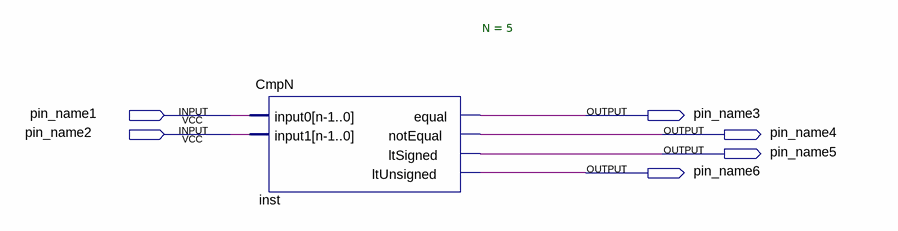
[diagram p0: schematic sheet]
// Quartus schematic CmpN_Demo.bdf as structural Verilog: 1 symbols, 6 pins
module CmpN_Demo (
  input  pin_name1,
  input  pin_name2,
  output pin_name3,
  output pin_name4,
  output pin_name5,
  output pin_name6
);

  CmpN #(.N(5)) inst (
    .input0({5{pin_name1}}), .input1({5{pin_name2}}), .equal(pin_name3), .notEqual(pin_name4),
    .ltSigned(pin_name5), .ltUnsigned(pin_name6));
endmodule
